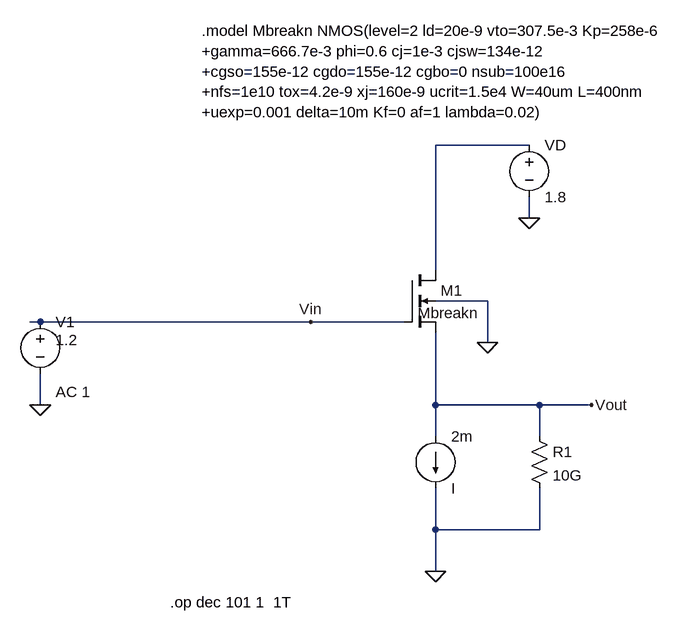
[diagram p0: schematic NMOS-C_coomon.asc]
NMOS-C_coomon.asc, the LTspice schematic file:
Version 4
SHEET 1 1560 832
WIRE 416 112 272 112
WIRE 416 224 416 192
WIRE 272 304 272 112
WIRE 352 352 272 352
WIRE -336 384 -352 384
WIRE 80 384 -336 384
WIRE 224 384 80 384
WIRE 352 416 352 352
WIRE -336 512 -336 464
WIRE 272 512 272 400
WIRE 432 512 272 512
WIRE 512 512 432 512
WIRE 272 560 272 512
WIRE 432 560 432 512
WIRE 272 704 272 640
WIRE 432 704 432 640
WIRE 432 704 272 704
WIRE 272 768 272 704
FLAG 512 512 Vout
FLAG 272 768 0
FLAG 416 224 0
FLAG -336 512 0
FLAG 80 384 Vin
FLAG 352 416 0
SYMBOL voltage 416 96 R0
WINDOW 123 0 0 Left 0
WINDOW 39 0 0 Left 0
SYMATTR InstName VD
SYMATTR Value 1.8
SYMBOL current 272 560 R0
WINDOW 0 24 80 Left 2
WINDOW 3 24 0 Left 2
WINDOW 123 0 0 Left 0
WINDOW 39 0 0 Left 0
SYMATTR InstName I
SYMATTR Value 2m
SYMBOL voltage -336 368 R0
WINDOW 123 24 124 Left 2
WINDOW 39 0 0 Left 0
WINDOW 3 24 44 Left 2
SYMATTR Value2 AC 1
SYMATTR Value 1.2
SYMATTR InstName V1
SYMBOL nmos4 224 304 R0
WINDOW 3 21 66 Left 2
SYMATTR Value Mbreakn
SYMATTR InstName M1
SYMBOL res 416 544 R0
SYMATTR InstName R1
SYMATTR Value 10G
TEXT -88 -64 Left 2 !.model Mbreakn NMOS(level=2 ld=20e-9 vto=307.5e-3 Kp=258e-6\n+gamma=666.7e-3 phi=0.6 cj=1e-3 cjsw=134e-12\n+cgso=155e-12 cgdo=155e-12 cgbo=0 nsub=100e16\n+nfs=1e10 tox=4.2e-9 xj=160e-9 ucrit=1.5e4 W=40um L=400nm\n+uexp=0.001 delta=10m Kf=0 af=1 lambda=0.02)
TEXT -136 816 Left 2 !.op dec 101 1  1T

The netlist it stands for:
* NMOS-C_coomon.asc
VD N001 0 1.8
I Vout 0 2m
V1 Vin 0 1.2 AC 1
M1 N001 Vin Vout 0 Mbreakn
R1 Vout 0 10G
.model NMOS NMOS
.model PMOS PMOS
.lib standard.mos
.model Mbreakn NMOS(level=2 ld=20e-9 vto=307.5e-3 Kp=258e-6
+gamma=666.7e-3 phi=0.6 cj=1e-3 cjsw=134e-12
+cgso=155e-12 cgdo=155e-12 cgbo=0 nsub=100e16
+nfs=1e10 tox=4.2e-9 xj=160e-9 ucrit=1.5e4 W=40um L=400nm
+uexp=0.001 delta=10m Kf=0 af=1 lambda=0.02)
.op dec 101 1  1T
.backanno
.end